# EAGLE schematic first model (EAGLE 9.5.1)
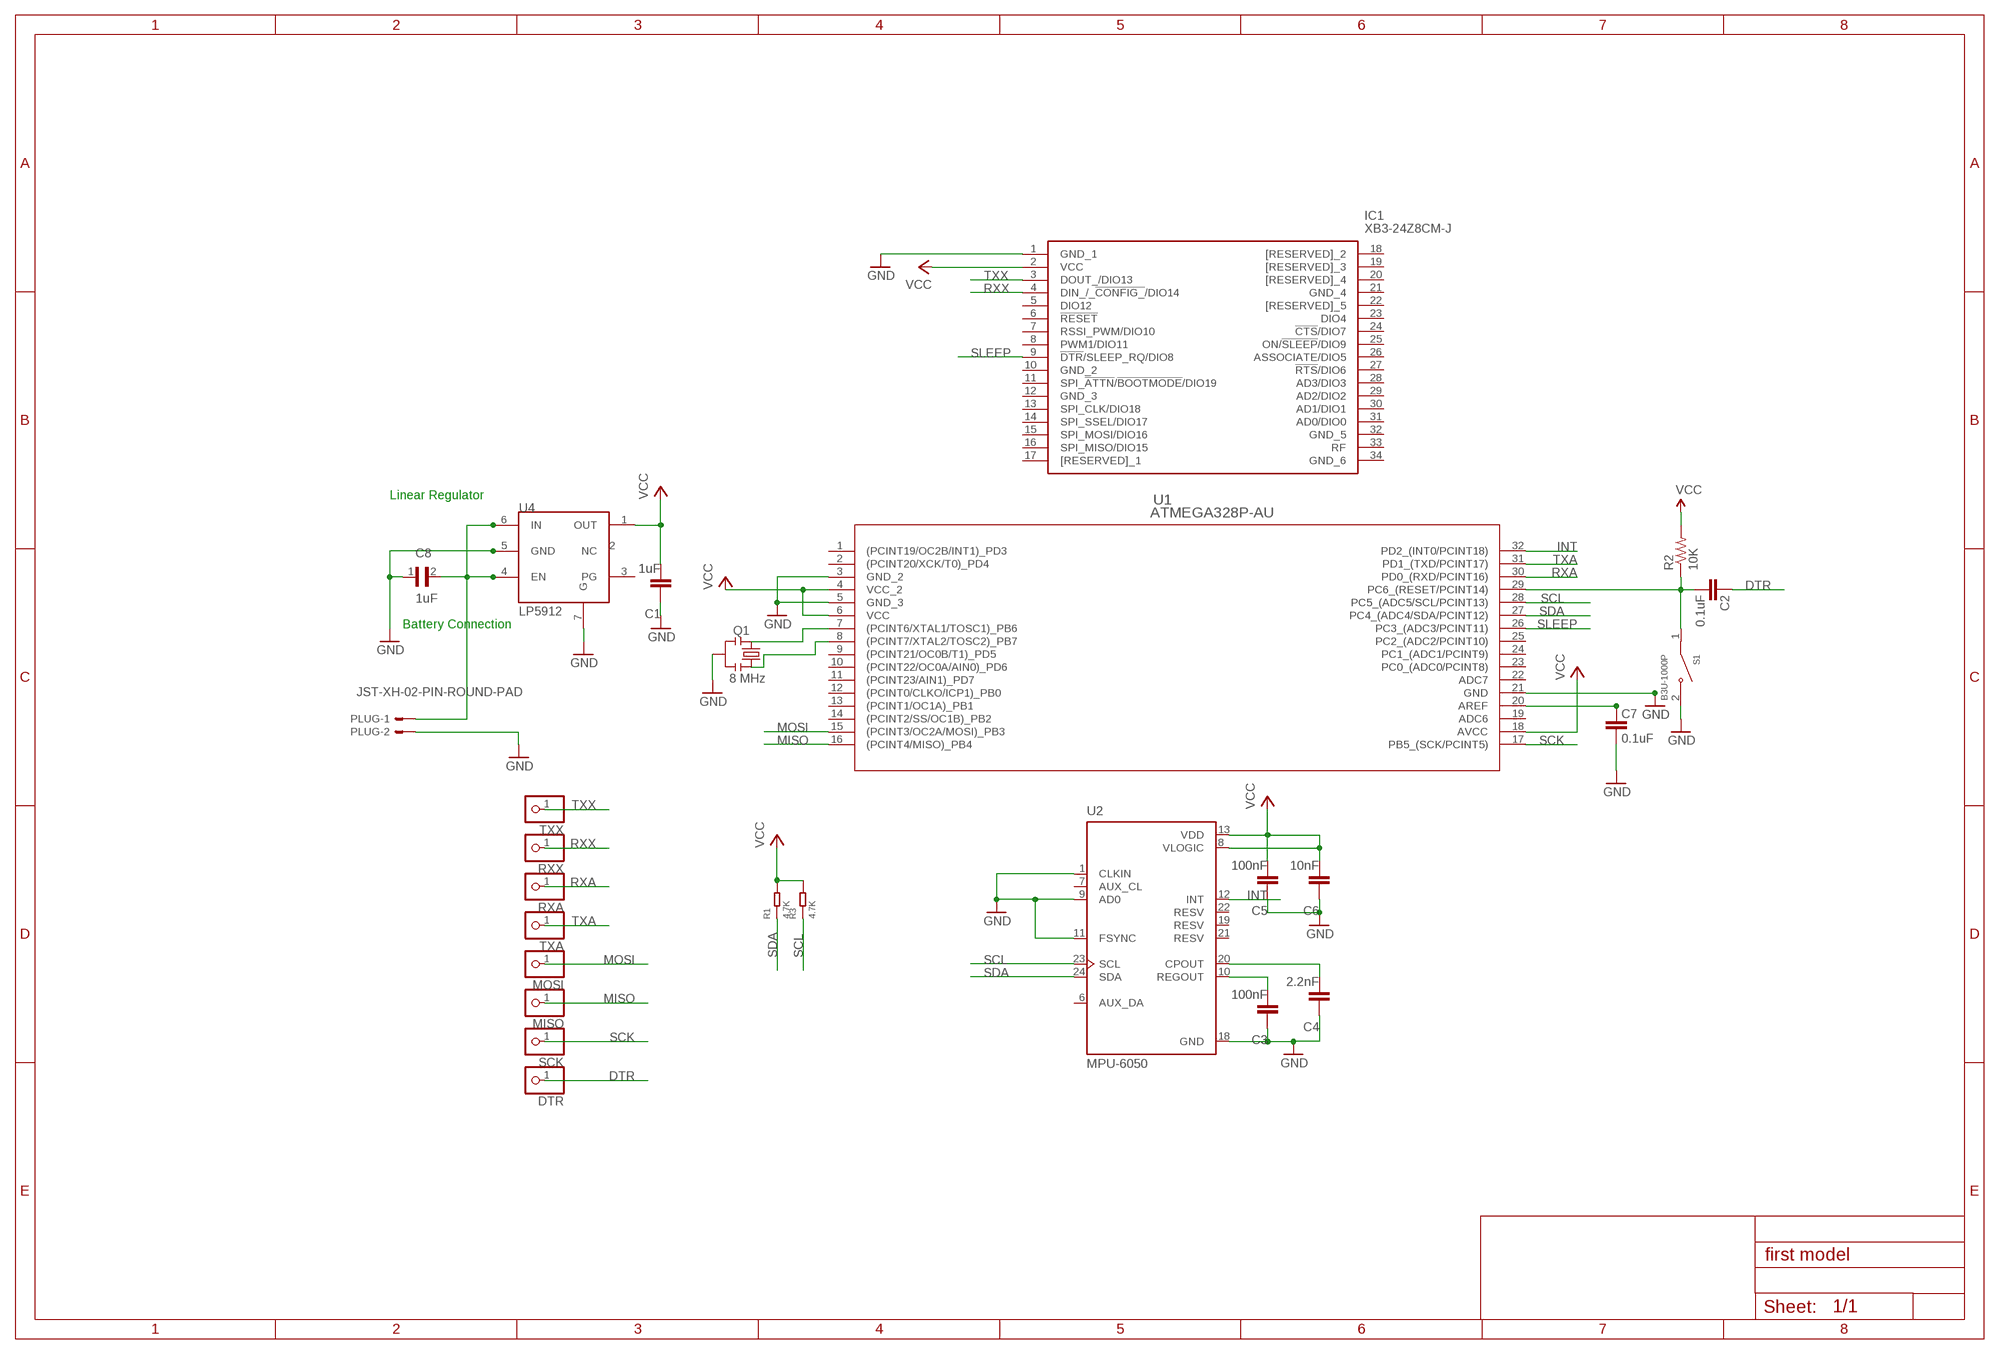
[diagram p0: schematic, sheet 1]

## Parts
C1  1uF  C-EUC0603  [C0603]
C2  0.1uF  CAP0603-CAP  [0603-CAP]
C3  100nF  C-EUC0603  [C0603]
C4  2.2nF  C-EUC0603  [C0603]
C5  100nF  C-EUC0603  [C0603]
C6  10nF  C-EUC0603  [C0603]
C7  0.1uF  CAP0603-CAP  [0603-CAP]
C8  1uF  0402YD105MAT2A  [CAPC1005X71N]
DTR  DTR  PINHD-1X1  [1X01]
IC1  XB3-24Z8CM-J  [XB324Z8CMJ]
MISO  PINHD-1X1  [1X01]
MOSI  PINHD-1X1  [1X01]
PLUG  JST-XH-02-PIN-ROUND-PAD  [JST-XH-02-PACKAGE-ROUND-PAD]
Q1  8 MHz  RESONATOR1:1  [RESONATOR-SMD-1:1]
R1  4.7K  SMD-RES-4.7K-5%-1/16W(0402)  [R0402]
R2  10K  RESISTOR0603-RES  [0603-RES]
R3  4.7K  SMD-RES-4.7K-5%-1/16W(0402)  [R0402]
RXA  PINHD-1X1  [1X01]
RXX  PINHD-1X1  [1X01]
S1  B3U-1000P  [SW_B3U-1000P]
SCK  PINHD-1X1  [1X01]
TXA  PINHD-1X1  [1X01]
TXX  PINHD-1X1  [1X01]
U1  ATMEGA328P-AU  [32A]
U2  MPU-6050  [QFN50P400X400X95-24N]
U4  LP5912  [LP5912]

## Nets
BATTERY: C8.2 PLUG.1 U4.4(EN) U4.6(IN)
DTR: C2.2 DTR.1
GND [vcc]: C1.1 C3.1 C4.1 C5.1 C6.1 C7.1 C8.1 IC1.1(GND_1) PLUG.2 Q1.2 S1.2 U1.3(GND_2) U1.5(GND_3) U1.21(GND) U2.1(CLKIN) U2.9(AD0) U2.11(FSYNC) U2.18(GND) U4.5(GND) U4.7(G)
INT: U1.32(PD2_(INT0/PCINT18)) U2.12(INT)
MISO: MISO.1 U1.16((PCINT4/MISO)_PB4)
MOSI: MOSI.1 U1.15((PCINT3/OC2A/MOSI)_PB3)
N$1: C7.2 U1.20(AREF)
N$2: Q1.1 U1.7((PCINT6/XTAL1/TOSC1)_PB6)
N$3: C3.2 U2.10(REGOUT)
N$4: C4.2 U2.20(CPOUT)
N$5: Q1.3 U1.8((PCINT7/XTAL2/TOSC2)_PB7)
RESET: C2.1 R2.1 S1.1 U1.29(PC6_(RESET/PCINT14))
RXA: RXA.1 U1.30(PD0_(RXD/PCINT16))
RXX: IC1.4(DIN_/_!CONFIG_!/DIO14) RXX.1
SCK: SCK.1 U1.17(PB5_(SCK/PCINT5))
SCL: R3.1 U1.28(PC5_(ADC5/SCL/PCINT13)) U2.23(SCL)
SDA: R1.1 U1.27(PC4_(ADC4/SDA/PCINT12)) U2.24(SDA)
SLEEP: IC1.9(!DTR!/SLEEP_RQ/DIO8) U1.26(PC3_(ADC3/PCINT11))
TXA: TXA.1 U1.31(PD1_(TXD/PCINT17))
TXX: IC1.3(DOUT_/DIO13) TXX.1
VCC: C1.2 C5.2 C6.2 IC1.2(VCC) R1.2 R2.2 R3.2 U1.4(VCC_2) U1.6(VCC) U1.18(AVCC) U2.8(VLOGIC) U2.13(VDD) U4.1(OUT)
Unconnected: IC1.5(DIO12) IC1.6(!RESET) IC1.7(RSSI_PWM/DIO10) IC1.8(PWM1/DIO11) IC1.10(GND_2) IC1.11(SPI_!ATTN!/!BOOTMODE!/DIO19) IC1.12(GND_3) IC1.13(SPI_CLK/DIO18) IC1.14(SPI_SSEL/DIO17) IC1.15(SPI_MOSI/DIO16) IC1.16(SPI_MISO/DIO15) IC1.17([RESERVED]_1) IC1.18([RESERVED]_2) IC1.19([RESERVED]_3) IC1.20([RESERVED]_4) IC1.21(GND_4) IC1.22([RESERVED]_5) IC1.23(DIO4) IC1.24(!CTS!/DIO7) IC1.25(ON/!SLEEP!/DIO9) IC1.26(ASSOCIATE/DIO5) IC1.27(!RTS!/DIO6) IC1.28(AD3/DIO3) IC1.29(AD2/DIO2) IC1.30(AD1/DIO1) IC1.31(AD0/DIO0) IC1.32(GND_5) IC1.33(RF) IC1.34(GND_6) U1.1((PCINT19/OC2B/INT1)_PD3) U1.2((PCINT20/XCK/T0)_PD4) U1.9((PCINT21/OC0B/T1)_PD5) U1.10((PCINT22/OC0A/AIN0)_PD6) U1.11((PCINT23/AIN1)_PD7) U1.12((PCINT0/CLKO/ICP1)_PB0) U1.13((PCINT1/OC1A)_PB1) U1.14((PCINT2/SS/OC1B)_PB2) U1.19(ADC6) U1.22(ADC7) U1.23(PC0_(ADC0/PCINT8)) U1.24(PC1_(ADC1/PCINT9)) U1.25(PC2_(ADC2/PCINT10)) U2.6(AUX_DA) U2.7(AUX_CL) U2.19(RESV) U2.21(RESV) U2.22(RESV) U4.2(NC) U4.3(PG)

## Notes on the sheet
- Linear Regulator
- Battery Connection

## Library data of the parts
C1 C3-C6 = rcl:C-EU: CAPACITOR, European symbol; SPICEPREFIX: C
C2 C7 = SparkFun:CAP: Capacitor Standard 0603 ceramic capacitor, and 0.1" leaded capacitor.
C8 = Capacitor1uF:0402YD105MAT2A: CAP 1UF 16VDC X5R 20% SMD 0402; AVAILABILITY: Unavailable; DESCRIPTION: Cap 1uf 16vdc X5r 20% Smd 0402; MF: AVX; MP: 0402YD105MAT2A; PACKAGE: 1005 AVX; PRICE: None
DTR MISO MOSI RXA RXX TXA TXX = pinhead:PINHD-1X1: PIN HEADER
IC1 = XB3-24Z8CM-J:XB3-24Z8CM-J: Zigbee Modules (802.15.4) XBee3 ,2.4 Ghz ZB 3.0, Chip Ant, MMT Source: Datasheet <https://www.digi.com/resources/documentation/digidocs/pdfs/90001543.pdf>; DESCRIPTION: Zigbee Modules (802.15.4) XBee3 ,2.4 Ghz ZB 3.0, Chip Ant, MMT; HEIGHT: 4mm; MANUFACTURER_NAME: Digi International; MANUFACTURER_PART_NUMBER: XB3-24Z8CM-J; MOUSER_PART_NUMBER: 888-XB3-24Z8CM-J; MOUSER_PRICE-STOCK: https://www.mouser.com/Search/Refine.aspx?Keyword=888-XB3-24Z8CM-J
PLUG = Rembrandt Electronics - JST XH Connectors v1-0:JST-XH-02-PIN: JST XH Connector 2 Pin Wire to board connector. Pitch: 2,54 mm, (0.100") Number of pins: 2 Created by Rembrandt Electronics www.rembrandtelectronics.com
Q1 = Testing:RESONATOR: Resonator Small SMD resonator. This is the itty bitty 10/20MHz resonators with built in caps. CSTCE10M0G55 and CSTCE20M0V53. Footprint for SMD has been used in SFE production for years, and does work okay. 1:1 is an attempt to get larger fillets on the sides so it will be easier to inspect these solders in our AOI machine. The pads have been minimized to match the actual metal under the resonator. To see this relation, it includes an image import of the bottom side of the component. Imported to scale on layer 200.
R1 R3 = RES-4.7K-SMD-5_-1_16W_0402_:SMD-RES-4.7K-5%-1/16W(0402): 301010010; AVAILABILITY: Unavailable; DESCRIPTION: Res Thick Film 0402 4.7K Ohm 5% 0.063W_1/16W_ ?100ppm/C Molded SMD Paper T/R; MF: Yageo; MP: RC0402JR074K7L; PACKAGE: 0402 Yageo; PRICE: None
R2 = SparkFun:RESISTOR: Resistor Basic schematic elements and footprints for 0603, 1206, and PTH resistors.
S1 = B3U-1000P:B3U-1000P: Switch Tactile N.O. SPST Round Button Gull Wing 0.05A 12VDC 1.5N SMD Embossed T/R; AVAILABILITY: Unavailable; DESCRIPTION: Tactile Switch SPST-NO Top Actuated Surface Mount; MF: Omron; MP: B3U-1000P; PACKAGE: None; PRICE: None
SCK = pinhead:PINHD-1X1: PIN HEADER; SPICEPREFIX: X
U1 = ATMEGA328P-AU:ATMEGA328P-AU; BUILT_BY: EMA_UL_Team; MANUFACTURER_PART_NUMBER: ATMEGA328P-AU; VENDOR: Atmel
U2 = MPU-6050:MPU-6050: MPU-6050 Six-Axis (Gyro + Accelerometer) MEMS MotionTracking™ Devices; AVAILABILITY: Unavailable; DESCRIPTION: 3-axis gyroscope, 3-axis accelerometer in a 4x4x0.9 housing; MF: TDK InvenSense; MP: MPU-6050; PACKAGE: QFN-24 InvenSense; PRICE: None
U4 = electronic-labs:LP5912

## Net classes
0 default: width 0.203 mm
1 vcc: width 0.254 mm